# EAGLE design temp_board2 - itr2_V2 (EAGLE 9.6.2)
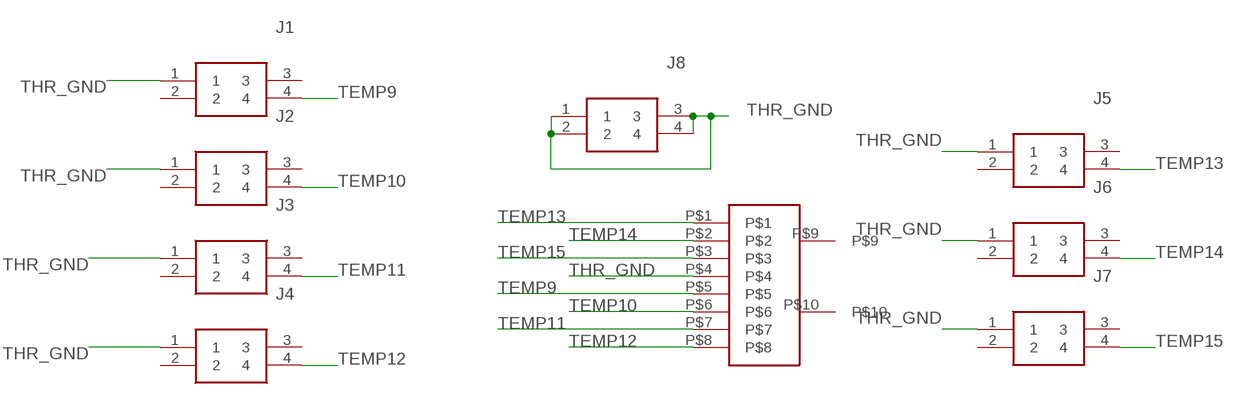
[diagram p0: schematic, sheet 1]

## Parts
J1  43045-0415  [43045-04YY_15,16,17]
J2  43045-0415  [43045-04YY_15,16,17]
J3  43045-0415  [43045-04YY_15,16,17]
J4  43045-0415  [43045-04YY_15,16,17]
J5  43045-0415  [43045-04YY_15,16,17]
J6  43045-0415  [43045-04YY_15,16,17]
J7  43045-0415  [43045-04YY_15,16,17]
J8  43045-0415  [43045-04YY_15,16,17]
U$36  VERTICALBMS8  [VERTICALBMS8]

## Nets
TEMP9: J1.4 U$36.P$5
TEMP10: J2.4 U$36.P$6
TEMP11: J3.4 U$36.P$7
TEMP12: J4.4 U$36.P$8
TEMP13: J5.4 U$36.P$1
TEMP14: J6.4 U$36.P$2
TEMP15: J7.4 U$36.P$3
THR_GND: J1.1 J2.1 J3.1 J4.1 J5.1 J6.1 J7.1 J8.1 J8.2 J8.3 J8.4 U$36.P$4
Unconnected: J1.2 J1.3 J2.2 J2.3 J3.2 J3.3 J4.2 J4.3 J5.2 J5.3 J6.2 J6.3 J7.2 J7.3 U$36.P$9 U$36.P$10

## Library data of the parts
J1-J8 = 43045-0415:43045-0415: Micro-Fit 3.0 Vertical Header, 3.00mm Pitch, Dual Row, 4 Circuits, with PCB Press-fit Metal Retention Clip, Glow-Wire Capable Source: Datasheet <https://www.molex.com/pdm_docs/sd/430450416_sd.pdf>; DESCRIPTION: Micro-Fit 3.0 Vertical Header, 3.00mm Pitch, Dual Row, 4 Circuits, with PCB Press-fit Metal Retention Clip, Glow-Wire Capable; HEIGHT: 9.91mm; MANUFACTURER_NAME: Molex; MANUFACTURER_PART_NUMBER: 43045-0415; MOUSER_PART_NUMBER: 538-43045-0415; MOUSER_PRICE-STOCK: https://www.mouser.co.uk/ProductDetail/Molex/43045-0415?qs=jbJnFeK%2FK6yEAHtN9jCMQg%3D%3D
U$36 = IIT_BOMBAY_Racing2:VERTICALBMS8

## Board
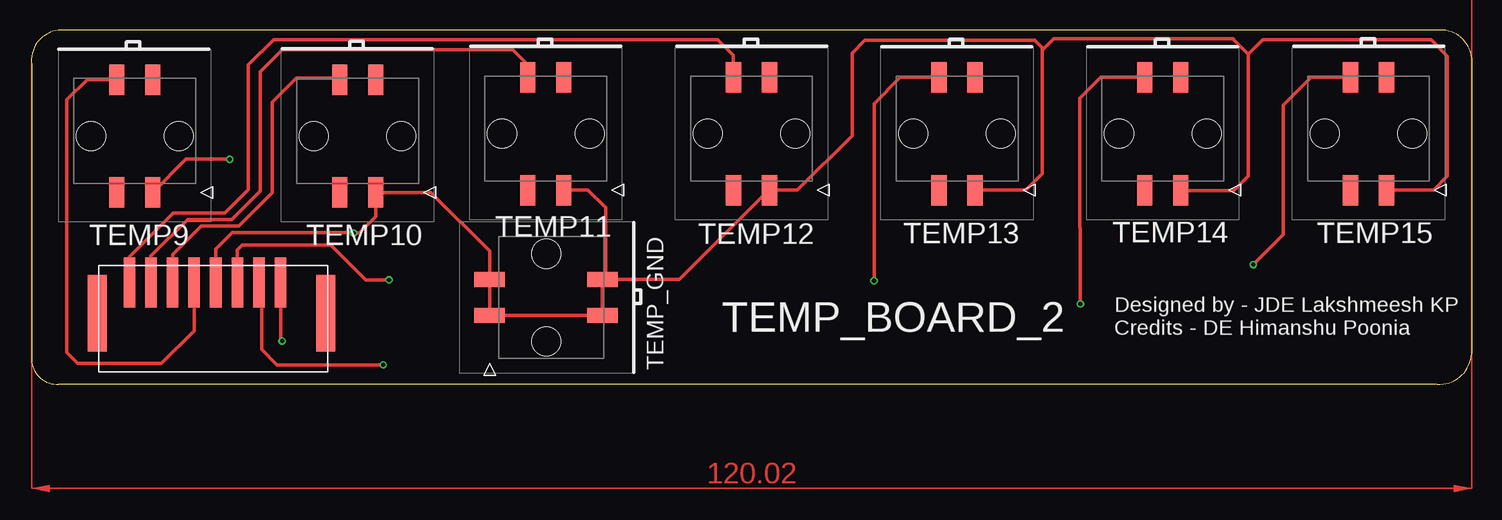
[diagram p1: board, top side]
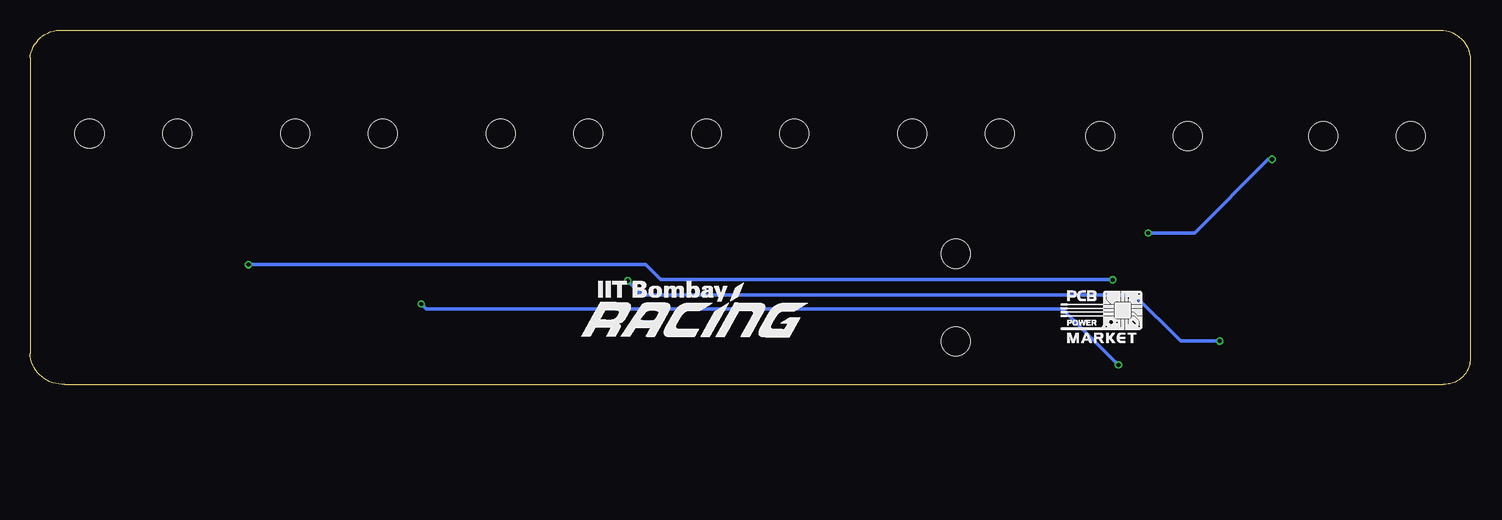
[diagram p2: board, bottom side, seen from below]

Size 120.03 x 29.56 mm. Coordinates in mm from the lower left corner, seen from the top.
Outline: 117.14,0 2.25,0 arc-90 0.02,2.03 0.02,26.67 arc-90 2.25,29.54 117.14,29.54 arc-90 120.03,27.23 120.03,2.59 arc-90 117.14,0
Copper layers (1*16): Top 0.035mm / dielectric 1.5mm / Bottom 0.035mm
Design rules "PCB_Power": minimum track width 5mil, minimum drill 10mil, track to track 5mil, track to pad 5mil, pad to pad 5mil, via to via 5mil, smd to smd 5mil, copper to edge 10mil, drill to drill 6mil, minimum pad ring 5mil, minimum via ring 5mil, stop-mask expansion 3mil, vias tented up to drill 0mil, thermal gap 10mil

### Footprints (pad centres in the part's own frame; a part is rotated, then mirrored left to right if it is on the bottom)
43045-04YY_15,16,17 = smd 1.27 x 2.54: 1 1.5,-4.7; 2 -1.5,-4.7; 3 1.5,4.7; 4 -1.5,4.7 | hole 2.41: 3.65,0; -3.65,0
VERTICALBMS8 = smd 0.97 x 4.2: P$1 -6.246,23; P$2 -4.446,23; P$3 -2.646,23; P$4 -0.846,23; P$5 0.954,23; P$6 2.754,23; P$7 4.554,23; P$8 6.354,23 | smd 1.6 x 6.4: P$9 -10,25.558; P$10 9.02,25.558

### Placement (x,y rotation side)
J1  8.62,20.71 0 top
J2  27.19,20.71 0 top
J3  42.87,20.9 0 top
J4  60.01,20.9 0 top
J5  77.15,20.9 0 top
J6  94.29,20.9 0 top
J7  111.43,20.9 0 top
J8  42.89,7.24 270 top
U$8  LOGO_PCBPOWER  [270X170]  34.18,3.43 0 bottom
U$23  [IITBR_LOGO_180DIFF]  74.85,3.51 0 bottom
U$36  14.52,31.5 180 top

### Tracks (layer width: path | path; a pad name or v marks a point on that pad's centre or on a via)
TEMP9
  Top 0.305: U$36.P$5 13.57,4.46 10.84,1.73 3.88,1.73 2.96,2.64 2.96,23.73 4.65,25.41 J1.4
TEMP10
  Top 0.305: U$36.P$6 11.77,10.81 14.14,13.19 17.27,13.19 20.08,16 20.08,23.55 22.07,25.53 25.57,25.53 J2.4
TEMP11
  Top 0.305: U$36.P$7 9.97,10.69 13.02,13.74 16.71,13.74 19.09,16.13 19.09,26.09 20.92,27.92 40.12,27.92 41.37,26.67 J3.4
TEMP12
  Top 0.305: U$36.P$8 8.17,10.64 11.83,14.3 16.12,14.3 18.08,16.26 18.08,26.65 20.19,28.76 57.21,28.76 58.51,27.46 J4.4
TEMP13  (via drill 0.35)
  Top 0.305: J5.4 72.41,25.6 70.22,23.42 v70.22,8.64 | v20.9,3.61 20.77,3.74 U$36.P$1
  Bottom 0.305: v20.9,3.61 24.15,3.61 28.01,7.47 69.06,7.47 v70.22,8.64
TEMP14  (via drill 0.35)
  Top 0.305: U$36.P$2 19.2,8.27 19.2,2.9 20.47,1.63 v29.33,1.63 | J6.4 89.12,25.6 87.37,23.85 87.37,13.08 87.42,13.03 v87.42,6.71
  Bottom 0.305: v29.33,1.63 34,6.3 87.01,6.3 v87.42,6.71
TEMP15  (via drill 0.35)
  Top 0.305: J7.4 106.67,25.6 104.34,23.27 104.34,12.5 v101.82,9.98 | U$36.P$3 17.17,11.21 17.6,11.64 24.94,11.64 27.86,8.71 v29.81,8.71
  Bottom 0.305: v29.81,8.71 29.84,8.74 67.48,8.74 68.73,9.98 v101.82,9.98
THR_GND  (via drill 0.35)
  Top 0.305: J5.1 82.86,16.2 84.24,17.58 84.24,27.87 | 84.24,27.87 84.24,28.09 83.64,28.7 69.46,28.7 68.4,27.64 68.4,20.75 63.84,16.2 J4.1 61.44,16.2 53.98,8.74 J8.4 | J7.1 116.85,16.2 118,17.35 118,27.38 116.66,28.73 102.63,28.73 101.43,27.52 | J6.1 95.81,16.18 100.22,16.18 101.43,17.39 101.43,27.52 | 84.24,27.87 85.21,28.83 100.15,28.83 100.2,28.78 100.2,28.76 101.43,27.52 | J1.1 12.88,18.77 v16.53,18.77 | U$36.P$4 15.37,11.29 16.73,12.65 26.82,12.65 v26.84,12.63 27.32,12.63 28.69,13.99 J2.1 33.29,16.01 38.19,11.1 J8.2 J8.1 J8.3 J8.4 | J3.1 46.38,16.2 47.85,14.73 47.85,9 J8.4
  Bottom 0.305: v16.53,18.77 16.83,18.77 22.98,12.63 v26.84,12.63
(copper drawn outside any net)
  shapes: Top area x1

### Text on the board
tNames: TEMP9 | TEMP10 | TEMP11 | TEMP_GND | TEMP12 | TEMP13 | TEMP14 | TEMP15 | TEMP_BOARD_2 | Designed by - JDE Lakshmeesh KP / Credits - DE Himanshu Poonia